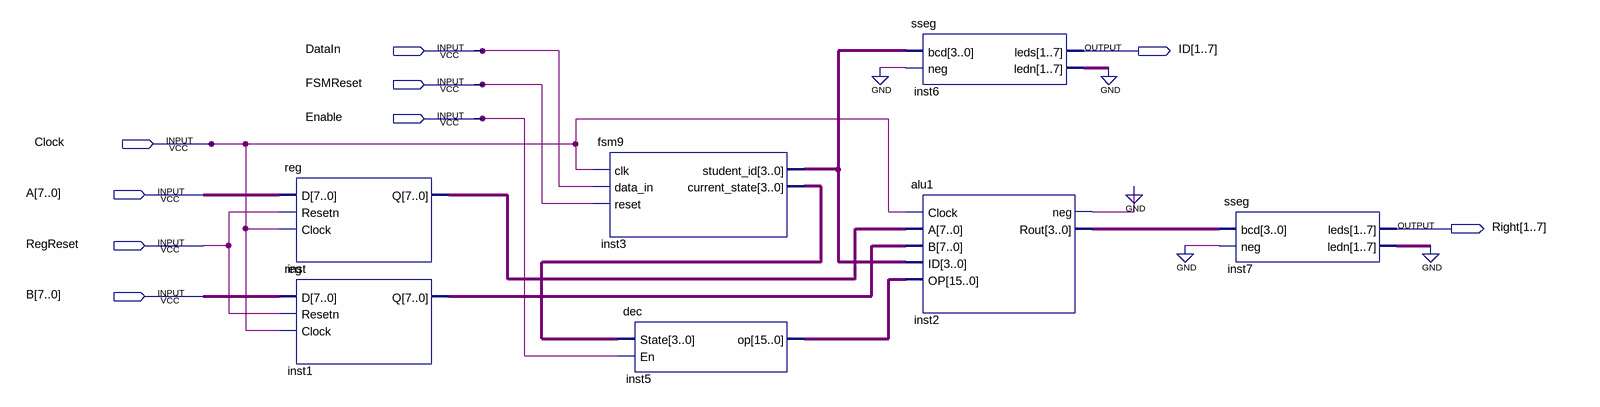
[diagram p0: schematic sheet]
// Quartus schematic core1.bdf as structural Verilog: 7 symbols, 9 pins
module core1 (
  input  DataIn,
  input  FSMReset,
  input  Enable,
  input  Clock,
  input  [7:0] A,
  input  RegReset,
  input  [7:0] B,
  output [1:7] ID,
  output [1:7] Right
);

  wire inst2_neg;
  wire [3:0] inst2_rout, inst3_current_state, inst3_student_id;
  wire [6:0] inst6_ledn, inst7_ledn;
  wire [7:0] inst1_q, inst_q;
  wire [15:0] inst5_op;

  \reg  inst (.D(A), .Resetn(RegReset), .Clock(Clock), .Q(inst_q));
  \reg  inst1 (.D(B), .Resetn(RegReset), .Clock(Clock), .Q(inst1_q));
  fsm9 inst3 (
    .clk(Clock), .data_in(DataIn), .reset(FSMReset), .student_id(inst3_student_id),
    .current_state(inst3_current_state));
  dec inst5 (.State(inst3_current_state), .En(Enable), .op(inst5_op));
  sseg inst6 (.bcd(inst3_student_id), .neg(1'b0), .leds(ID), .ledn(inst6_ledn));
  alu1 inst2 (
    .Clock(Clock), .A(inst_q), .B(inst1_q), .ID(inst3_student_id), .OP(inst5_op), .neg(inst2_neg),
    .Rout(inst2_rout));
  sseg inst7 (.bcd(inst2_rout), .neg(1'b0), .leds(Right), .ledn(inst7_ledn));
  // also tied to GND on the sheet: {inst6_ledn[0], inst6_ledn[1], inst6_ledn[2], inst6_ledn[3], inst6_ledn[4], inst6_ledn[5], inst6_ledn[6], inst7_ledn[0], inst7_ledn[1], inst7_ledn[2], inst7_ledn[3], inst7_ledn[4], inst7_ledn[5], inst7_ledn[6], inst2_neg}
endmodule
